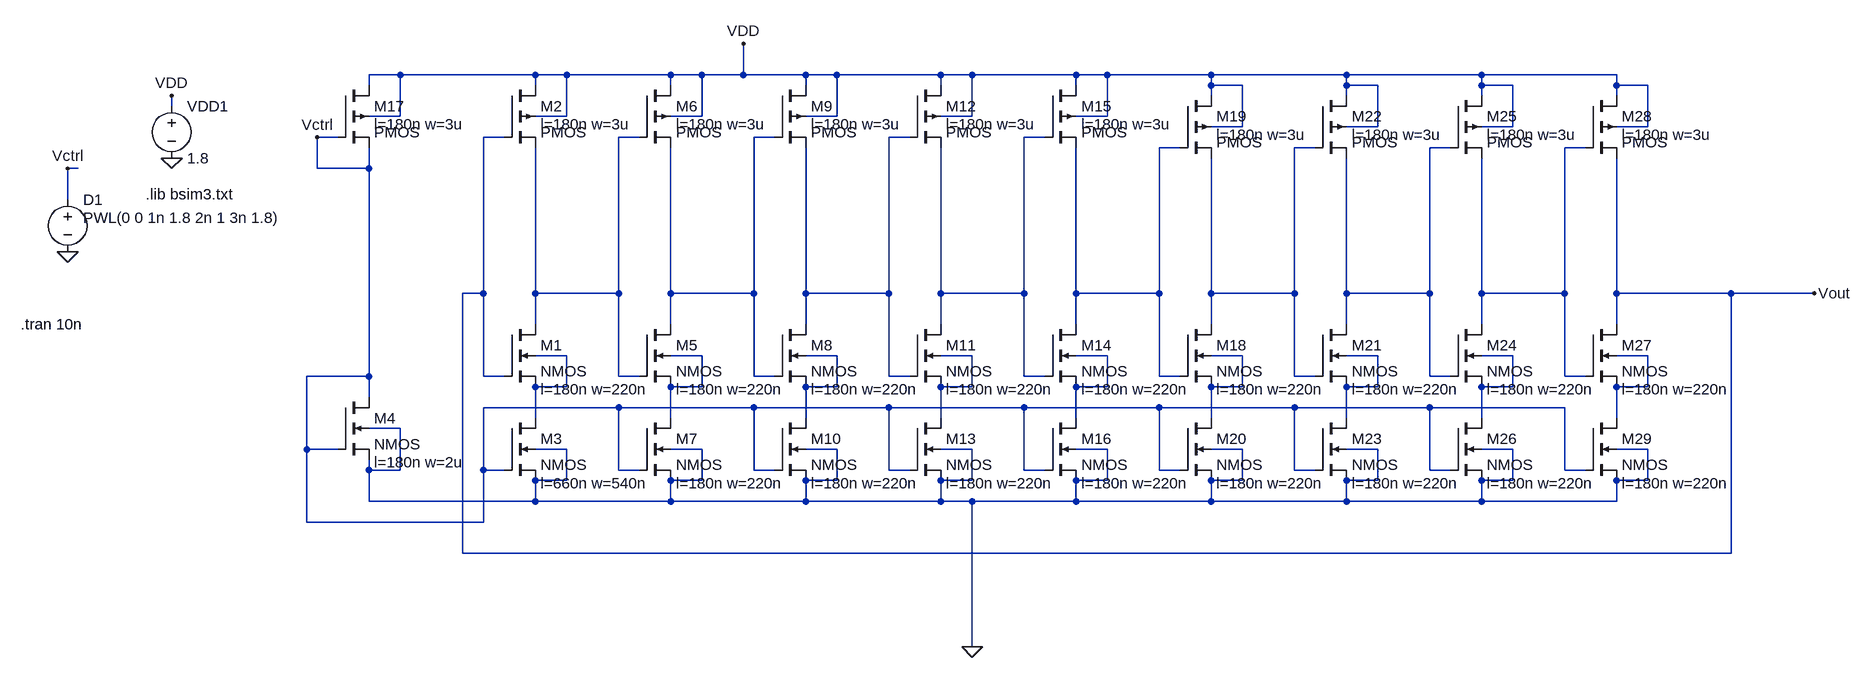
[diagram p0: schematic VCO2.asc]
VCO2.asc, the LTspice schematic file:
Version 4
SHEET 1 3924 724
WIRE -400 -224 -448 -224
WIRE -192 -224 -400 -224
WIRE -144 -224 -192 -224
WIRE 16 -224 -144 -224
WIRE 64 -224 16 -224
WIRE 128 -224 128 -272
WIRE 128 -224 64 -224
WIRE 224 -224 128 -224
WIRE 272 -224 224 -224
WIRE 432 -224 272 -224
WIRE 480 -224 432 -224
WIRE 640 -224 480 -224
WIRE 688 -224 640 -224
WIRE 848 -224 688 -224
WIRE 1056 -224 848 -224
WIRE 1264 -224 1056 -224
WIRE 1472 -224 1264 -224
WIRE -448 -208 -448 -224
WIRE -192 -208 -192 -224
WIRE 16 -208 16 -224
WIRE 224 -208 224 -224
WIRE 432 -208 432 -224
WIRE 640 -208 640 -224
WIRE 848 -208 848 -224
WIRE 896 -208 848 -208
WIRE 1056 -208 1056 -224
WIRE 1104 -208 1056 -208
WIRE 1264 -208 1264 -224
WIRE 1312 -208 1264 -208
WIRE 1472 -208 1472 -224
WIRE 1520 -208 1472 -208
WIRE 848 -192 848 -208
WIRE 1056 -192 1056 -208
WIRE 1264 -192 1264 -208
WIRE 1472 -192 1472 -208
WIRE -752 -176 -752 -192
WIRE -400 -160 -400 -224
WIRE -400 -160 -448 -160
WIRE -144 -160 -144 -224
WIRE -144 -160 -192 -160
WIRE 64 -160 64 -224
WIRE 64 -160 16 -160
WIRE 272 -160 272 -224
WIRE 272 -160 224 -160
WIRE 480 -160 480 -224
WIRE 480 -160 432 -160
WIRE 688 -160 688 -224
WIRE 688 -160 640 -160
WIRE 896 -144 896 -208
WIRE 896 -144 848 -144
WIRE 1104 -144 1104 -208
WIRE 1104 -144 1056 -144
WIRE 1312 -144 1312 -208
WIRE 1312 -144 1264 -144
WIRE 1520 -144 1520 -208
WIRE 1520 -144 1472 -144
WIRE -496 -128 -528 -128
WIRE -240 -128 -272 -128
WIRE -32 -128 -64 -128
WIRE 176 -128 144 -128
WIRE 384 -128 352 -128
WIRE 592 -128 560 -128
WIRE 800 -112 768 -112
WIRE 1008 -112 976 -112
WIRE 1216 -112 1184 -112
WIRE 1424 -112 1392 -112
WIRE -896 -80 -912 -80
WIRE -528 -80 -528 -128
WIRE -448 -80 -448 -112
WIRE -448 -80 -528 -80
WIRE -912 -32 -912 -80
WIRE -272 112 -272 -128
WIRE -272 112 -304 112
WIRE -192 112 -192 -112
WIRE -64 112 -64 -128
WIRE -64 112 -192 112
WIRE 16 112 16 -112
WIRE 144 112 144 -128
WIRE 144 112 16 112
WIRE 224 112 224 -112
WIRE 352 112 352 -128
WIRE 352 112 224 112
WIRE 432 112 432 -112
WIRE 560 112 560 -128
WIRE 560 112 432 112
WIRE 640 112 640 -112
WIRE 768 112 768 -112
WIRE 768 112 640 112
WIRE 848 112 848 -96
WIRE 976 112 976 -112
WIRE 976 112 848 112
WIRE 1056 112 1056 -96
WIRE 1184 112 1184 -112
WIRE 1184 112 1056 112
WIRE 1264 112 1264 -96
WIRE 1392 112 1392 -112
WIRE 1392 112 1264 112
WIRE 1472 112 1472 -96
WIRE 1648 112 1472 112
WIRE 1776 112 1648 112
WIRE -192 160 -192 112
WIRE 16 160 16 112
WIRE 224 160 224 112
WIRE 432 160 432 112
WIRE 640 160 640 112
WIRE 848 160 848 112
WIRE 1056 160 1056 112
WIRE 1264 160 1264 112
WIRE 1472 160 1472 112
WIRE -144 208 -192 208
WIRE 64 208 16 208
WIRE 272 208 224 208
WIRE 480 208 432 208
WIRE 688 208 640 208
WIRE 896 208 848 208
WIRE 1104 208 1056 208
WIRE 1312 208 1264 208
WIRE 1520 208 1472 208
WIRE -448 240 -448 -80
WIRE -448 240 -544 240
WIRE -272 240 -272 112
WIRE -240 240 -272 240
WIRE -64 240 -64 112
WIRE -32 240 -64 240
WIRE 144 240 144 112
WIRE 176 240 144 240
WIRE 352 240 352 112
WIRE 384 240 352 240
WIRE 560 240 560 112
WIRE 592 240 560 240
WIRE 768 240 768 112
WIRE 800 240 768 240
WIRE 976 240 976 112
WIRE 1008 240 976 240
WIRE 1184 240 1184 112
WIRE 1216 240 1184 240
WIRE 1392 240 1392 112
WIRE 1424 240 1392 240
WIRE -144 256 -144 208
WIRE -144 256 -192 256
WIRE 64 256 64 208
WIRE 64 256 16 256
WIRE 272 256 272 208
WIRE 272 256 224 256
WIRE 480 256 480 208
WIRE 480 256 432 256
WIRE 688 256 688 208
WIRE 688 256 640 256
WIRE 896 256 896 208
WIRE 896 256 848 256
WIRE 1104 256 1104 208
WIRE 1104 256 1056 256
WIRE 1312 256 1312 208
WIRE 1312 256 1264 256
WIRE 1520 256 1520 208
WIRE 1520 256 1472 256
WIRE -448 272 -448 240
WIRE -64 288 -272 288
WIRE 144 288 -64 288
WIRE 352 288 144 288
WIRE 560 288 352 288
WIRE 768 288 560 288
WIRE 976 288 768 288
WIRE 1184 288 976 288
WIRE 1392 288 1184 288
WIRE -192 304 -192 256
WIRE 16 304 16 256
WIRE 224 304 224 256
WIRE 432 304 432 256
WIRE 640 304 640 256
WIRE 848 304 848 256
WIRE 1056 304 1056 256
WIRE 1264 304 1264 256
WIRE 1472 304 1472 256
WIRE -400 320 -448 320
WIRE -544 352 -544 240
WIRE -496 352 -544 352
WIRE -144 352 -192 352
WIRE 64 352 16 352
WIRE 272 352 224 352
WIRE 480 352 432 352
WIRE 688 352 640 352
WIRE 896 352 848 352
WIRE 1104 352 1056 352
WIRE 1312 352 1264 352
WIRE 1520 352 1472 352
WIRE -448 384 -448 368
WIRE -400 384 -400 320
WIRE -400 384 -448 384
WIRE -272 384 -272 288
WIRE -240 384 -272 384
WIRE -64 384 -64 288
WIRE -32 384 -64 384
WIRE 144 384 144 288
WIRE 176 384 144 384
WIRE 352 384 352 288
WIRE 384 384 352 384
WIRE 560 384 560 288
WIRE 592 384 560 384
WIRE 768 384 768 288
WIRE 800 384 768 384
WIRE 976 384 976 288
WIRE 1008 384 976 384
WIRE 1184 384 1184 288
WIRE 1216 384 1184 384
WIRE 1392 384 1392 288
WIRE 1424 384 1392 384
WIRE -144 400 -144 352
WIRE -144 400 -192 400
WIRE 64 400 64 352
WIRE 64 400 16 400
WIRE 272 400 272 352
WIRE 272 400 224 400
WIRE 480 400 480 352
WIRE 480 400 432 400
WIRE 688 400 688 352
WIRE 688 400 640 400
WIRE 896 400 896 352
WIRE 896 400 848 400
WIRE 1104 400 1104 352
WIRE 1104 400 1056 400
WIRE 1312 400 1312 352
WIRE 1312 400 1264 400
WIRE 1520 400 1520 352
WIRE 1520 400 1472 400
WIRE -448 432 -448 384
WIRE -192 432 -192 400
WIRE -192 432 -448 432
WIRE 16 432 16 400
WIRE 16 432 -192 432
WIRE 224 432 224 400
WIRE 224 432 16 432
WIRE 432 432 432 400
WIRE 432 432 224 432
WIRE 480 432 432 432
WIRE 640 432 640 400
WIRE 640 432 480 432
WIRE 848 432 848 400
WIRE 848 432 640 432
WIRE 1056 432 1056 400
WIRE 1056 432 848 432
WIRE 1264 432 1264 400
WIRE 1264 432 1056 432
WIRE 1472 432 1472 400
WIRE 1472 432 1264 432
WIRE -544 464 -544 352
WIRE -272 464 -272 384
WIRE -272 464 -544 464
WIRE -304 512 -304 112
WIRE 1648 512 1648 112
WIRE 1648 512 -304 512
WIRE 480 656 480 432
FLAG 128 -272 VDD
FLAG -912 48 0
FLAG -752 -96 0
FLAG -752 -192 VDD
FLAG -912 -80 Vctrl
FLAG -528 -128 Vctrl
FLAG 480 656 0
FLAG 1776 112 Vout
SYMBOL nmos4 -240 160 R0
WINDOW 123 56 100 Left 2
SYMATTR Value2 l=180n w=220n
SYMATTR InstName M1
SYMBOL pmos4 -240 -208 R0
WINDOW 123 56 60 Left 2
SYMATTR Value2 l=180n w=3u
SYMATTR InstName M2
SYMBOL nmos4 -240 304 R0
WINDOW 123 56 100 Left 2
SYMATTR Value2 l=660n w=540n
SYMATTR InstName M3
SYMBOL nmos4 -496 272 R0
WINDOW 123 56 100 Left 2
SYMATTR Value2 l=180n w=2u
SYMATTR InstName M4
SYMBOL pmos4 -32 -208 R0
WINDOW 123 56 60 Left 2
SYMATTR Value2 l=180n w=3u
SYMATTR InstName M6
SYMBOL pmos4 176 -208 R0
WINDOW 123 56 60 Left 2
SYMATTR Value2 l=180n w=3u
SYMATTR InstName M9
SYMBOL pmos4 384 -208 R0
WINDOW 123 56 60 Left 2
SYMATTR Value2 l=180n w=3u
SYMATTR InstName M12
SYMBOL pmos4 592 -208 R0
WINDOW 123 56 60 Left 2
SYMATTR Value2 l=180n w=3u
SYMATTR InstName M15
SYMBOL pmos4 -496 -208 R0
WINDOW 123 56 60 Left 2
SYMATTR Value2 l=180n w=3u
SYMATTR InstName M17
SYMBOL voltage -912 -48 R0
WINDOW 123 0 0 Left 0
WINDOW 39 24 124 Left 2
WINDOW 3 24 44 Left 2
SYMATTR Value PWL(0 0 1n 1.8 2n 1 3n 1.8)
SYMATTR InstName D1
SYMBOL voltage -752 -192 R0
WINDOW 123 0 0 Left 0
WINDOW 39 24 124 Left 2
SYMATTR InstName VDD1
SYMATTR Value 1.8
SYMBOL pmos4 800 -192 R0
WINDOW 123 56 60 Left 2
SYMATTR Value2 l=180n w=3u
SYMATTR InstName M19
SYMBOL pmos4 1008 -192 R0
WINDOW 123 56 60 Left 2
SYMATTR Value2 l=180n w=3u
SYMATTR InstName M22
SYMBOL pmos4 1216 -192 R0
WINDOW 123 56 60 Left 2
SYMATTR Value2 l=180n w=3u
SYMATTR InstName M25
SYMBOL pmos4 1424 -192 R0
WINDOW 123 56 60 Left 2
SYMATTR Value2 l=180n w=3u
SYMATTR InstName M28
SYMBOL nmos4 -32 160 R0
WINDOW 123 56 100 Left 2
SYMATTR Value2 l=180n w=220n
SYMATTR InstName M5
SYMBOL nmos4 -32 304 R0
WINDOW 123 56 100 Left 2
SYMATTR Value2 l=180n w=220n
SYMATTR InstName M7
SYMBOL nmos4 176 160 R0
WINDOW 123 56 100 Left 2
SYMATTR Value2 l=180n w=220n
SYMATTR InstName M8
SYMBOL nmos4 176 304 R0
WINDOW 123 56 100 Left 2
SYMATTR Value2 l=180n w=220n
SYMATTR InstName M10
SYMBOL nmos4 384 160 R0
WINDOW 123 56 100 Left 2
SYMATTR Value2 l=180n w=220n
SYMATTR InstName M11
SYMBOL nmos4 384 304 R0
WINDOW 123 56 100 Left 2
SYMATTR Value2 l=180n w=220n
SYMATTR InstName M13
SYMBOL nmos4 592 160 R0
WINDOW 123 56 100 Left 2
SYMATTR Value2 l=180n w=220n
SYMATTR InstName M14
SYMBOL nmos4 592 304 R0
WINDOW 123 56 100 Left 2
SYMATTR Value2 l=180n w=220n
SYMATTR InstName M16
SYMBOL nmos4 800 160 R0
WINDOW 123 56 100 Left 2
SYMATTR Value2 l=180n w=220n
SYMATTR InstName M18
SYMBOL nmos4 800 304 R0
WINDOW 123 56 100 Left 2
SYMATTR Value2 l=180n w=220n
SYMATTR InstName M20
SYMBOL nmos4 1008 160 R0
WINDOW 123 56 100 Left 2
SYMATTR Value2 l=180n w=220n
SYMATTR InstName M21
SYMBOL nmos4 1008 304 R0
WINDOW 123 56 100 Left 2
SYMATTR Value2 l=180n w=220n
SYMATTR InstName M23
SYMBOL nmos4 1216 160 R0
WINDOW 123 56 100 Left 2
SYMATTR Value2 l=180n w=220n
SYMATTR InstName M24
SYMBOL nmos4 1216 304 R0
WINDOW 123 56 100 Left 2
SYMATTR Value2 l=180n w=220n
SYMATTR InstName M26
SYMBOL nmos4 1424 160 R0
WINDOW 123 56 100 Left 2
SYMATTR Value2 l=180n w=220n
SYMATTR InstName M27
SYMBOL nmos4 1424 304 R0
WINDOW 123 56 100 Left 2
SYMATTR Value2 l=180n w=220n
SYMATTR InstName M29
TEXT -984 160 Left 2 !.tran 10n
TEXT -792 -40 Left 2 !.lib bsim3.txt

The netlist it stands for:
* VCO2.asc
M1 N001 Vout N009 N009 NMOS l=180n w=220n
M2 VDD Vout N001 VDD PMOS l=180n w=3u
M3 N009 Vctrl 0 0 NMOS l=660n w=540n
M4 Vctrl Vctrl 0 0 NMOS l=180n w=2u
M6 VDD N001 N002 VDD PMOS l=180n w=3u
M9 VDD N002 N003 VDD PMOS l=180n w=3u
M12 VDD N003 N004 VDD PMOS l=180n w=3u
M15 VDD N004 N005 VDD PMOS l=180n w=3u
M17 VDD Vctrl Vctrl VDD PMOS l=180n w=3u
V§D1 Vctrl 0 PWL(0 0 1n 1.8 2n 1 3n 1.8)
VDD1 VDD 0 1.8
M19 VDD N005 N006 VDD PMOS l=180n w=3u
M22 VDD N006 N007 VDD PMOS l=180n w=3u
M25 VDD N007 N008 VDD PMOS l=180n w=3u
M28 VDD N008 Vout VDD PMOS l=180n w=3u
M5 N002 N001 N010 N010 NMOS l=180n w=220n
M7 N010 Vctrl 0 0 NMOS l=180n w=220n
M8 N003 N002 N011 N011 NMOS l=180n w=220n
M10 N011 Vctrl 0 0 NMOS l=180n w=220n
M11 N004 N003 N012 N012 NMOS l=180n w=220n
M13 N012 Vctrl 0 0 NMOS l=180n w=220n
M14 N005 N004 N013 N013 NMOS l=180n w=220n
M16 N013 Vctrl 0 0 NMOS l=180n w=220n
M18 N006 N005 N014 N014 NMOS l=180n w=220n
M20 N014 Vctrl 0 0 NMOS l=180n w=220n
M21 N007 N006 N015 N015 NMOS l=180n w=220n
M23 N015 Vctrl 0 0 NMOS l=180n w=220n
M24 N008 N007 N016 N016 NMOS l=180n w=220n
M26 N016 Vctrl 0 0 NMOS l=180n w=220n
M27 Vout N008 N017 N017 NMOS l=180n w=220n
M29 N017 Vctrl 0 0 NMOS l=180n w=220n
.model NMOS NMOS
.model PMOS PMOS
.lib standard.mos
.tran 10n
.lib bsim3.txt
.backanno
.end